# EAGLE design BBBBoat-cape (EAGLE 6.4)
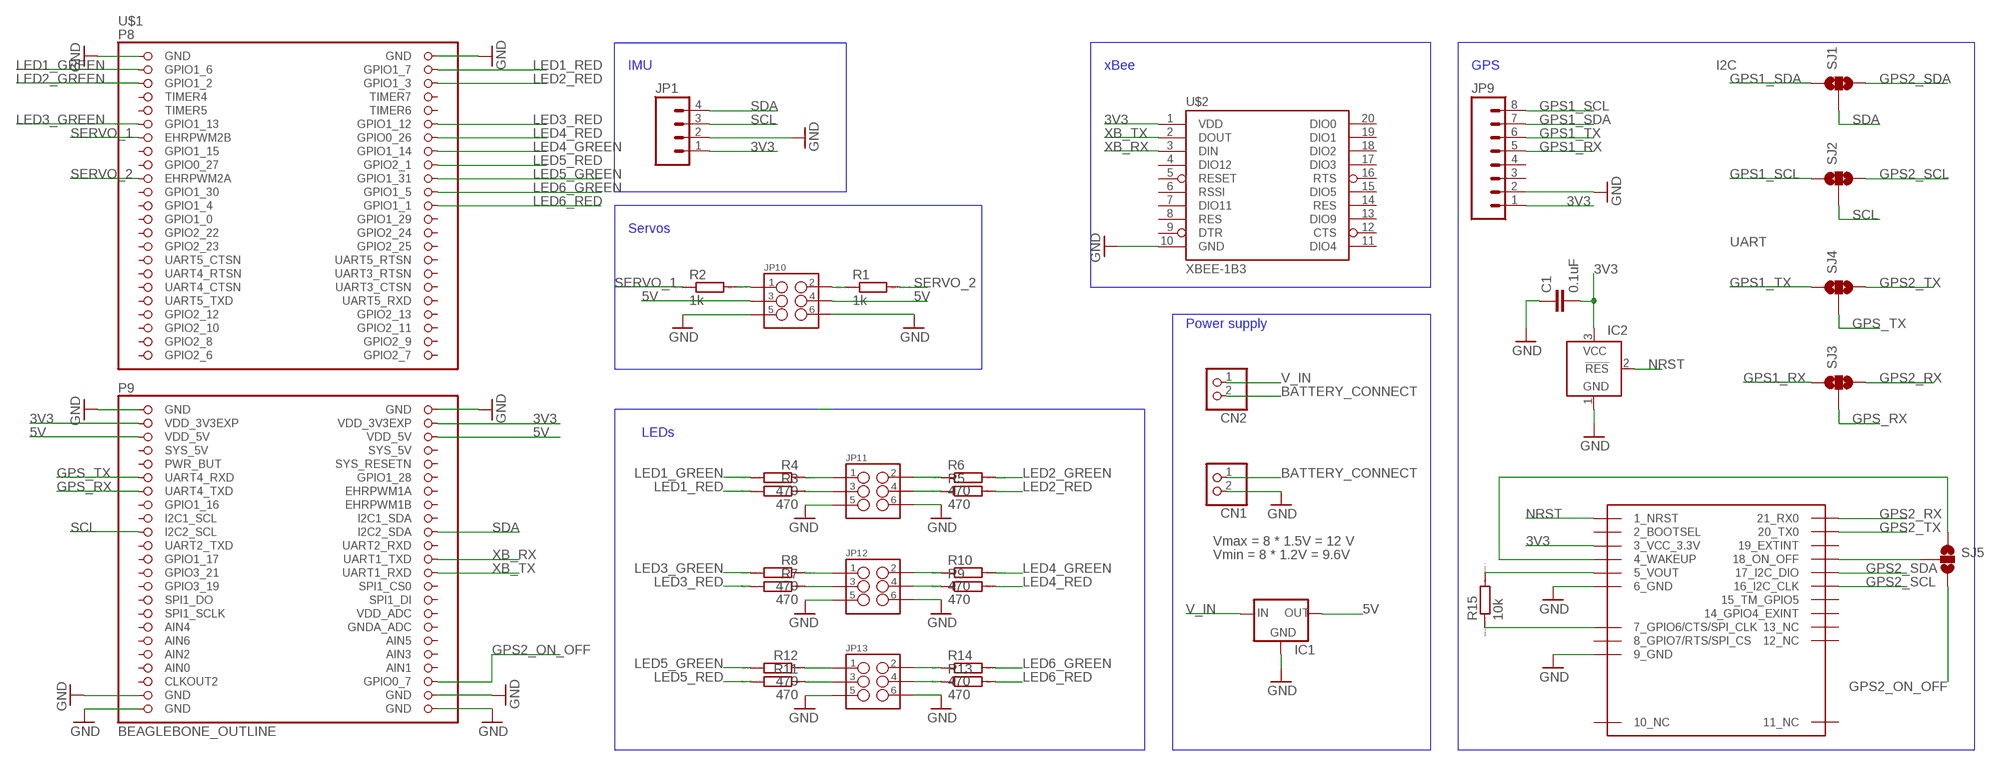
[diagram p0: schematic, sheet 1]

## Parts
C1  0.1uF  0.1UF-25V-5%(0603)  [0603-CAP]
CN1  JST_2PIN-SMT  [JST-PH-2-SMT]
CN2  JST_2PIN-SMT  [JST-PH-2-SMT]
IC1  V_REG_78XX-TO-220  [TO-220-ALT]
IC2  TCM809  [SOT23B-3]
JP1  M04SMD_STRAIGHT_COMBO  [1X04_SMD_STRAIGHT_COMBO]
JP9  M08SMD-MALE  [1X08_SMD_MALE]
JP10  M03X2  [2X3_SMD]
JP11  M03X2  [2X3_SMD]
JP12  M03X2  [2X3_SMD]
JP13  M03X2  [2X3_SMD]
R1  1k  R0204/7  [0204/7]
R2  1k  R0204/7  [0204/7]
R3  470  R0204/7  [0204/7]
R4  470  R0204/7  [0204/7]
R5  470  R0204/7  [0204/7]
R6  470  R0204/7  [0204/7]
R7  470  R0204/7  [0204/7]
R8  470  R0204/7  [0204/7]
R9  470  R0204/7  [0204/7]
R10  470  R0204/7  [0204/7]
R11  470  R0204/7  [0204/7]
R12  470  R0204/7  [0204/7]
R13  470  R0204/7  [0204/7]
R14  470  R0204/7  [0204/7]
R15  10k  R0204/7  [0204/7]
SJ1  SOLDERJUMPER_2WAYT  [SJ_2]
SJ2  SOLDERJUMPER_2WAYT  [SJ_2]
SJ3  SOLDERJUMPER_2WAYT  [SJ_2]
SJ4  SOLDERJUMPER_2WAYT  [SJ_2]
SJ5  SOLDERJUMPER_2WAYT  [SJ_2]
U$1  BEAGLEBONE_OUTLINE  [BEAGLEBONE_SHIELD]
U$2  XBEE-1B3  [XBEE-SMD]
U$3  A2035-H  [A2035H]

## Nets
3V3: C1.2 IC2.3(VCC) JP1.1 JP9.1 U$1.49(VDD_3V3EXP) U$1.50(VDD_3V3EXP) U$2.1(VDD) U$3.3_VCC_3.3V
5V: IC1.OUT JP10.3 JP10.4 U$1.51(VDD_5V) U$1.52(VDD_5V)
BATTERY_CONNECT: CN1.1 CN2.2
GND: C1.1 CN1.2 IC1.GND IC2.1(GND) JP1.2 JP9.2 JP10.5 JP10.6 JP11.5 JP11.6 JP12.5 JP12.6 JP13.5 JP13.6 U$1.1(GND) U$1.2(GND) U$1.47(GND) U$1.48(GND) U$1.89(GND) U$1.90(GND) U$1.91(GND) U$1.92(GND) U$2.10(GND) U$3.6_GND U$3.9_GND
GPS1_RX: JP9.5 SJ3.1
GPS1_SCL: JP9.8 SJ2.1
GPS1_SDA: JP9.7 SJ1.1
GPS1_TX: JP9.6 SJ4.1
GPS2_ON_OFF: SJ5.3 U$1.88(GPIO0_7)
GPS2_RX: SJ3.3 U$3.21_RX0
GPS2_SCL: SJ2.3 U$3.16_I2C_CLK
GPS2_SDA: SJ1.3 U$3.17_I2C_DIO
GPS2_TX: SJ4.3 U$3.20_TX0
GPS_RX: SJ3.2 U$1.59(UART4_TXD)
GPS_TX: SJ4.2 U$1.57(UART4_RXD)
LED1_GREEN: R4.2 U$1.3(GPIO1_6)
LED1_RED: R3.2 U$1.4(GPIO1_7)
LED2_GREEN: R6.2 U$1.5(GPIO1_2)
LED2_RED: R5.2 U$1.6(GPIO1_3)
LED3_GREEN: R8.2 U$1.11(GPIO1_13)
LED3_RED: R7.2 U$1.12(GPIO1_12)
LED4_GREEN: R10.2 U$1.16(GPIO1_14)
LED4_RED: R9.2 U$1.14(GPIO0_26)
LED5_GREEN: R12.2 U$1.20(GPIO1_31)
LED5_RED: R11.2 U$1.18(GPIO2_1)
LED6_GREEN: R14.2 U$1.22(GPIO1_5)
LED6_RED: R13.2 U$1.24(GPIO1_1)
N$1: JP11.3 R3.1
N$2: JP11.1 R4.1
N$3: JP11.4 R5.1
N$4: JP11.2 R6.1
N$5: JP12.3 R7.1
N$6: JP12.1 R8.1
N$7: JP12.4 R9.1
N$8: JP12.2 R10.1
N$9: JP13.3 R11.1
N$10: JP13.1 R12.1
N$11: JP13.4 R13.1
N$12: JP13.2 R14.1
N$13: R15.1 U$3.7_GPIO6/CTS/SPI_CLK
N$14: JP10.2 R1.1
N$15: R15.2 U$3.5_VOUT
N$16: JP10.1 R2.2
N$18: SJ5.2 U$3.18_ON_OFF
N$19: SJ5.1 U$3.4_WAKEUP
NRST: IC2.2(!RES) U$3.1_NRST
SCL: JP1.3 SJ2.2 U$1.65(I2C2_SCL)
SDA: JP1.4 SJ1.2 U$1.66(I2C2_SDA)
SERVO_1: R2.1 U$1.13(EHRPWM2B)
SERVO_2: R1.2 U$1.19(EHRPWM2A)
V_IN: CN2.1 IC1.IN
XB_RX: U$1.70(UART1_TXD) U$2.3(DIN)
XB_TX: U$1.72(UART1_RXD) U$2.2(DOUT)
Unconnected: JP9.3 JP9.4 U$1.7(TIMER4) U$1.8(TIMER7) U$1.9(TIMER5) U$1.10(TIMER6) U$1.15(GPIO1_15) U$1.17(GPIO0_27) U$1.21(GPIO1_30) U$1.23(GPIO1_4) U$1.25(GPIO1_0) U$1.26(GPIO1_29) U$1.27(GPIO2_22) U$1.28(GPIO2_24) U$1.29(GPIO2_23) U$1.30(GPIO2_25) U$1.31(UART5_CTSN) U$1.32(UART5_RTSN) U$1.33(UART4_RTSN) U$1.34(UART3_RTSN) U$1.35(UART4_CTSN) U$1.36(UART3_CTSN) U$1.37(UART5_TXD) U$1.38(UART5_RXD) U$1.39(GPIO2_12) U$1.40(GPIO2_13) U$1.41(GPIO2_10) U$1.42(GPIO2_11) U$1.43(GPIO2_8) U$1.44(GPIO2_9) U$1.45(GPIO2_6) U$1.46(GPIO2_7) U$1.54(SYS_5V) U$1.55(PWR_BUT) U$1.56(SYS_RESETN) U$1.58(GPIO1_28) U$1.60(EHRPWM1A) U$1.61(GPIO1_16) U$1.62(EHRPWM1B) U$1.63(I2C1_SCL) U$1.64(I2C1_SDA) U$1.67(UART2_TXD) U$1.68(UART2_RXD) U$1.69(GPIO1_17) U$1.71(GPIO3_21) U$1.73(GPIO3_19) U$1.74(SPI1_CS0) U$1.75(SPI1_DO) U$1.76(SPI1_DI) U$1.77(SPI1_SCLK) U$1.78(VDD_ADC) U$1.79(AIN4) U$1.80(GNDA_ADC) U$1.81(AIN6) U$1.82(AIN5) U$1.83(AIN2) U$1.84(AIN3) U$1.86(AIN1) U$1.87(CLKOUT2) U$2.4(DIO12) U$2.5(RESET) U$2.6(RSSI) U$2.7(DIO11) U$2.8(RES) U$2.9(DTR) U$2.11(DIO4) U$2.12(CTS) U$2.13(DIO9) U$2.14(RES) U$2.15(DIO5) U$2.16(RTS) U$2.17(DIO3) U$2.18(DIO2) U$2.19(DIO1) U$2.20(DIO0) U$3.2_BOOTSEL U$3.8/GPIO7/RTS/SPI_CS(8_GPIO7/RTS/SPI_CS) U$3.10_NC U$3.11_NC U$3.12_NC U$3.13_GPIO4_EXTINT(13_NC) U$3.14_GPIO_EXTINT(14_GPIO4_EXINT) U$3.15_TM_GPIO5 U$3.19_EXTINT

## Notes on the sheet
- IMU | xBee | GPS | I2C
- Servos
- UART
- Power supply
- LEDs
- Vmax = 8 * 1.5V = 12 V
- Vmin = 8 * 1.2V = 9.6V

## Power pins joined to a net without a drawn wire
AIN0: U$1.85(AIN0)
SYS_5V: U$1.53(SYS_5V)

## Library data of the parts
C1 = SparkFun-Capacitors:0.1UF-25V-5%(0603): CAP-08604; PROD_ID: CAP-08604
CN1 CN2 = adafruit:JST_2PIN: JST 2-Pin Connectors of various flavors SMT-RA (S2B-PH-SM4) 4UConnector #17311 SMT (B2B-PH-SM4) THM-RA (S2B-PH) THM (B2B-PH)
IC1 = SparkFun-PowerIC:V_REG_78XX: Voltage Regulator Standard 7805 5V regulator. IGO (Input Ground Output). Spark Fun Electronics SKU : COM-00107
IC2 = telcom:TCM809: POWER SUPPLY MONITOR replacement for Maxim MAX809 and MAX810; MF: MICROCHIP; MPN: TCM809MENB713; OC_FARNELL: 9762744; OC_NEWARK: 96K3998
JP1 = SparkFun-Connectors:M04: Header 4 Standard 4-pin 0.1" header. Use with straight break away headers (SKU : PRT-00116), right angle break away headers (PRT-00553), swiss pins (PRT-00743), machine pins (PRT-00117), and female headers (PRT-00115). Molex polarized connector foot print use with SKU : PRT-08231 with associated crimp pins and housings. 1MM SMD Version SKU: PRT-10208
JP9 = SparkFun-Connectors:M08: Header 8 Standard 8-pin 0.1" header. Use with straight break away headers (SKU : PRT-00116), right angle break away headers (PRT-00553), swiss pins (PRT-00743), machine pins (PRT-00117), and female headers (PRT-00115).; PROD_ID: CONN-11292
JP10-JP13 = SparkFun-Connectors:M03X2: 2x3 .1" header. Shrouded, with keying- CONN-10681 SMT- CONN-11415 Pogo pins- HW-11044; PROD_ID: CONN-11290
R1-R15 = eagle-ltspice:R: RESISTOR, European symbol; SPICEMODEL: NONE; SPICEPREFIX: R
SJ1-SJ5 = SparkFun-Retired:SOLDERJUMPER_2WAY: Solder Jumper 2 way solder jumper
U$1 = adafruit:BEAGLEBONE_OUTLINE: Should match A3 pinout - but not completely tested
U$2 = SparkFun-RF:XBEE-1: Xbee module footprints SMT header is CONN-09042.; PROD_ID: CONN-09042
U$3 = smaria:A2035-H

## Board
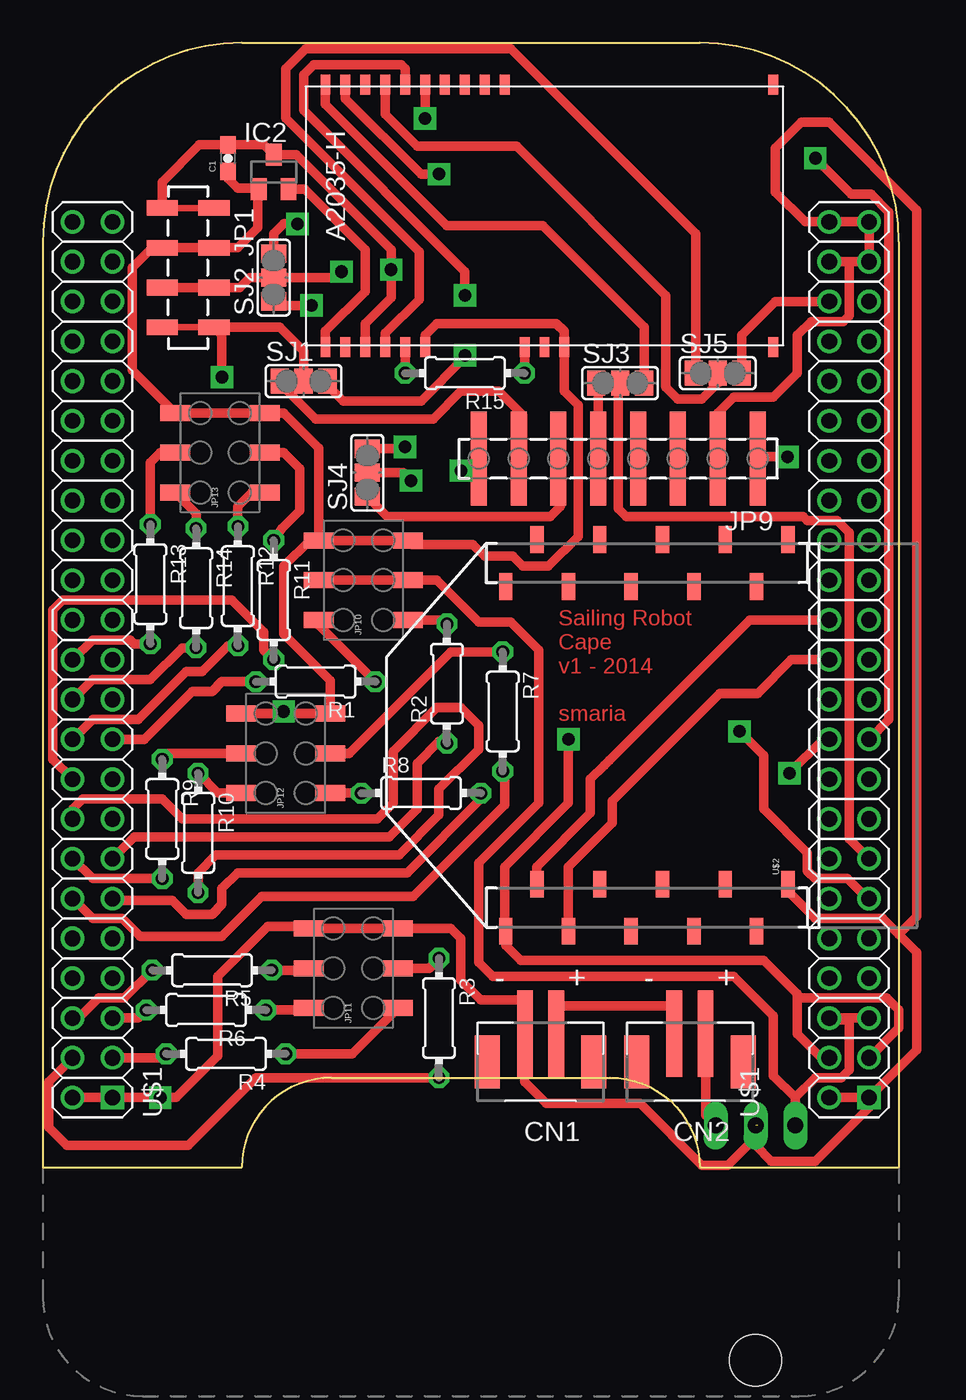
[diagram p1: board, top side]
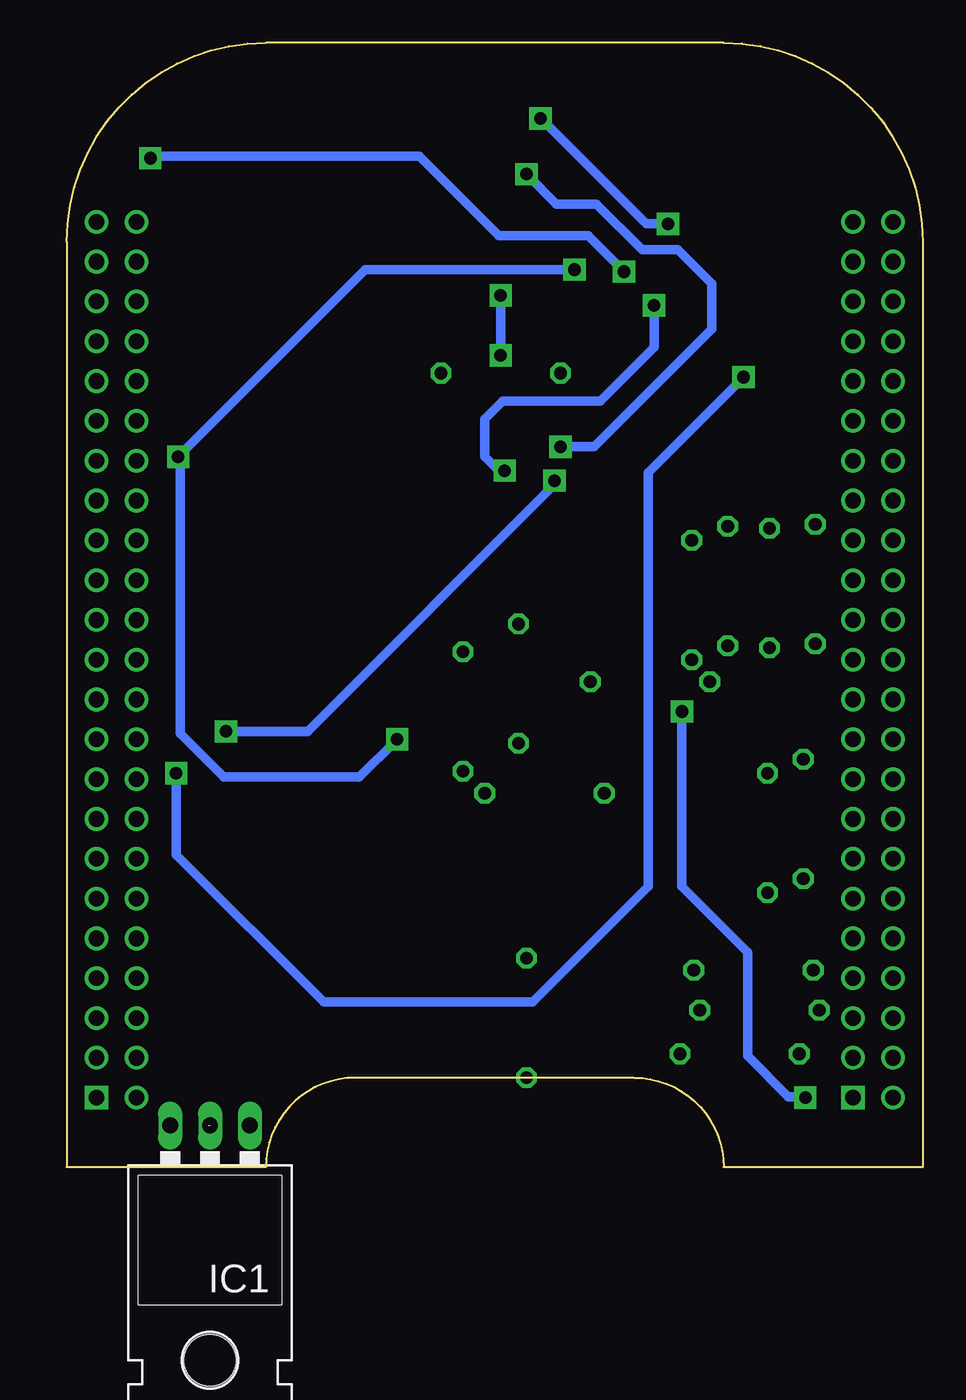
[diagram p2: board, bottom side, seen from below]

Size 54.61 x 71.75 mm. Coordinates in mm from the lower left corner, seen from the top.
Copper layers (1*16): Top 0.035mm / dielectric 1.5mm / Bottom 0.035mm
Design rules "default": minimum track width 10mil, minimum drill 24mil, track to track 8mil, track to pad 8mil, pad to pad 8mil, via to via 8mil, smd to smd 8mil, copper to edge 40mil, drill to drill 8mil, minimum pad ring 10mil, minimum via ring 8mil, stop-mask expansion 4mil, vias tented up to drill 0mil, thermal gap 10mil

### Footprints (pad centres in the part's own frame; a part is rotated, then mirrored left to right if it is on the bottom)
0603-CAP = smd 1.1 x 1: 1 -0.85,0; 2 0.85,0
JST-PH-2-SMT = smd 1 x 5.5: 1 -1,-1.8; 2 1,-1.8 | smd 1.6 x 3.4: NC1 -3.4,0; NC2 3.4,0
TO-220-ALT = drill 1.016 long: GND 0,-3.81; IN -2.54,-3.81; OUT 2.54,-3.81 | hole 3.302: 0,11.176
SOT23B-3 = smd 1 x 1.4: 1 -0.95,-1.1; 2 0.95,-1.1; 3 0,1.1
1X04_SMD_STRAIGHT_COMBO = smd 1 x 2: 1 0,-1.65; 1-2 0,1.65; 2 2.54,1.65; 2-2 2.54,-1.65; 3 5.08,-1.65; 3-2 5.08,1.65; 4 7.62,1.65; 4-2 7.62,-1.65
1X08_SMD_MALE = smd 1.02 x 6: 1 0,0; 2 2.54,0; 3 5.08,0; 4 7.62,0; 5 10.16,0; 6 12.7,0; 7 15.24,0; 8 17.78,0
2X3_SMD = smd 1.02 x 1.9: 1 -2.54,-2.85; 2 -2.54,2.85; 3 0,-2.85; 4 0,2.85; 5 2.54,-2.85; 6 2.54,2.85
0204/7 = drill 0.813 octagon: 1 -3.81,0; 2 3.81,0
SJ_2 = smd 1.168 x 1.6: 1 -1.524,0; 2 0,0; 3 1.524,0
BEAGLEBONE_SHIELD = drill 1 square: 1 4.445,19.05; 47 52.705,19.05 | drill 1: 2 1.905,19.05; 3 4.445,21.59; 4 1.905,21.59; 5 4.445,24.13; 6 1.905,24.13; 7 4.445,26.67; 8 1.905,26.67; 9 4.445,29.21; 10 1.905,29.21; 11 4.445,31.75; 12 1.905,31.75; 13 4.445,34.29; 14 1.905,34.29; 15 4.445,36.83; 16 1.905,36.83; 17 4.445,39.37; 18 1.905,39.37; 19 4.445,41.91; 20 1.905,41.91; 21 4.445,44.45; 22 1.905,44.45; 23 4.445,46.99; 24 1.905,46.99; 25 4.445,49.53; 26 1.905,49.53; 27 4.445,52.07; 28 1.905,52.07; 29 4.445,54.61; 30 1.905,54.61; 31 4.445,57.15; 32 1.905,57.15; 33 4.445,59.69; 34 1.905,59.69; 35 4.445,62.23; 36 1.905,62.23; 37 4.445,64.77; 38 1.905,64.77; 39 4.445,67.31; 40 1.905,67.31; 41 4.445,69.85; 42 1.905,69.85; 43 4.445,72.39; 44 1.905,72.39; 45 4.445,74.93; 46 1.905,74.93; 48 50.165,19.05; 49 52.705,21.59; 50 50.165,21.59; 51 52.705,24.13; 52 50.165,24.13; 53 52.705,26.67; 54 50.165,26.67; 55 52.705,29.21; 56 50.165,29.21; 57 52.705,31.75; 58 50.165,31.75; 59 52.705,34.29; 60 50.165,34.29; 61 52.705,36.83; 62 50.165,36.83; 63 52.705,39.37; 64 50.165,39.37; 65 52.705,41.91; 66 50.165,41.91; 67 52.705,44.45; 68 50.165,44.45; 69 52.705,46.99; 70 50.165,46.99; 71 52.705,49.53; 72 50.165,49.53; 73 52.705,52.07; 74 50.165,52.07; 75 52.705,54.61; 76 50.165,54.61; 77 52.705,57.15; 78 50.165,57.15; 79 52.705,59.69; 80 50.165,59.69; 81 52.705,62.23; 82 50.165,62.23; 83 52.705,64.77; 84 50.165,64.77; 85 52.705,67.31; 86 50.165,67.31; 87 52.705,69.85; 88 50.165,69.85; 89 52.705,72.39; 90 50.165,72.39; 91 52.705,74.93; 92 50.165,74.93
XBEE-SMD = smd 1.7 x 0.85: 1 -12.5,20; 2 -9.5,18; 3 -12.5,16; 4 -9.5,14; 5 -12.5,12; 6 -9.5,10; 7 -12.5,8; 8 -9.5,6; 9 -12.5,4; 10 -9.5,2; 11 12.5,2; 12 9.5,4; 13 12.5,6; 14 9.5,8; 15 12.5,10; 16 9.5,12; 17 12.5,14; 18 9.5,16; 19 12.5,18; 20 9.5,20
A2035H = smd 1.27 x 0.635: 1_NRST 16.637,1.27; 2_BOOTSEL 16.637,2.54; 3_VCC_3.3V 16.637,3.81; 4_WAKEUP 16.637,5.08; 5_VOUT 16.637,6.35; 6_GND 16.637,7.62; 7_GPIO6/CTS/SPI_CLK 16.637,13.97; 8/GPIO7/RTS/SPI_CS 16.637,15.24; 9_GND 16.637,16.51; 10_NC 16.637,29.845; 11_NC -0.127,29.845; 12_NC -0.127,12.7; 13_GPIO4_EXTINT -0.127,11.43; 14_GPIO_EXTINT -0.127,10.16; 15_TM_GPIO5 -0.127,8.89; 16_I2C_CLK -0.127,7.62; 17_I2C_DIO -0.127,6.35; 18_ON_OFF -0.127,5.08; 19_EXTINT -0.127,3.81; 20_TX0 -0.127,2.54; 21_RX0 -0.127,1.27

### Placement (x,y rotation side)
C1  11.81,64.39 90 top
CN1  31.75,6.73 180 top
CN2  41.27,6.73 180 top
IC1  45.47,-1.14 180 bottom
IC2  14.73,63.5 0 top
JP1  9.27,61.21 270 top
JP9  45.59,45.21 180 top
JP10  20.45,37.47 90 top
JP11  19.81,12.7 90 top
JP12  15.49,26.42 90 top
JP13  11.3,45.59 90 top
R1  17.4,30.99 180 top
R2  25.78,30.86 90 top
R3  25.27,9.52 270 top
R4  11.68,7.24 180 top
R5  10.79,12.57 180 top
R6  10.41,10.03 180 top
R7  29.34,29.08 270 top
R8  24.13,23.88 0 top
R9  7.62,22.22 270 top
R10  9.91,21.34 270 top
R11  14.73,36.19 270 top
R12  12.45,37.08 270 top
R13  6.86,37.21 270 top
R14  9.78,36.96 270 top
R15  26.92,50.67 180 top
SJ1  16.64,50.16 0 top
SJ2  14.73,56.77 90 top
SJ3  36.83,50.04 0 top
SJ4  20.7,44.32 90 top
SJ5  43.05,50.67 0 top
U$1  0,-14.61 0 top
U$2  49.53,27.56 90 top
U$3  16.76,68.96 270 top

### Tracks (layer width: path | path; a pad name or v marks a point on that pad's centre or on a via)
3V3  (via drill 0.8 pad 1.42)
  Top 0.61: JP1.1 7.62,62.86 9.99,65.24 C1.2 14.09,65.24 IC2.3 16.17,64.6 22.23,58.55 v22.23,57.28 22.23,55.5 20.57,53.85 U$3.3_VCC_3.3V | v47.5,45.34 45.72,45.34 JP9.1 | U$1.50 49.66,6.98 48.13,8.51 48.13,10.79 | 48.13,10.79 48.13,11.05 45.97,13.21 30.48,13.21 29.53,14.16 U$2.1 29.46,15.12 29.46,19.18 33.53,23.24 v33.53,27.3 | U$1.49 54.61,8.89 54.61,10.03 53.85,10.79 48.13,10.79
  Bottom 0.61: v33.53,27.3 35.94,24.89 44.58,24.89 47.37,27.69 47.37,45.21 v47.5,45.34 35.56,57.28 v22.23,57.28
5V
  Top 0.61: IC1.OUT 48.01,4.44 | 48.01,4.44 49.28,5.71 50.93,5.71 51.43,6.22 51.43,9.4 50.29,9.4 U$1.52 U$1.51 | JP10.4 JP10.3 25.15,37.47 27.81,34.8 29.85,34.8 31.62,33.02 31.62,23.24 27.81,19.43 27.81,13.08 28.7,12.19 44.07,12.19 46.61,9.65 46.61,5.84 48.01,4.44
BATTERY_CONNECT
  Top 0.61: CN1.1 32.75,10.14 32.89,10.29 40.39,10.29 40.51,10.16 40.51,9.18 CN2.2
GND  (via drill 0.8 pad 1.42)  (1 unrouted)
  Top 0.61: JP12.6 JP12.5 | C1.1 11.81,63.12 12.45,62.48 13.7,62.48 IC2.1 13.72,62.33 13.72,59.94 12.45,58.67 JP1.2 10.79,58.55 10.67,58.67 6.99,58.67 5.71,57.4 5.71,50.87 JP13.6 JP13.5 15.37,48.13 17.6,45.9 JP10.6 | U$1.2 U$1.1 v7.49,4.44 8.51,4.44 11.18,7.11 11.18,12.19 14.35,15.37 16.84,15.37 JP11.6 JP11.5 26.04,15.24 26.67,14.61 26.67,11.94 27.94,10.67 30.75,10.67 CN1.2 30.75,5.44 32.13,4.06 38.1,4.06 42.04,0.13 43.69,0.13 45.59,2.03 45.59,2.67 45.47,2.79 | 51.43,57.78 U$1.89 U$1.91 U$1.92 48.64,60.32 46.74,62.23 46.74,65.02 48.39,66.67 50.16,66.67 55.75,61.09 55.75,16 54.61,14.86 | U$1.48 U$1.47 | U$2.10 47.53,17.62 49.28,15.88 53.59,15.88 54.61,14.86 | U$1.47 55.75,7.49 55.75,13.72 54.61,14.86 | IC1.GND 45.47,1.4 46.48,0.38 49.28,0.38 52.7,3.81 U$1.47 | U$1.90 51.43,57.78 | 51.43,57.78 51.43,54.36 51.05,53.97 49.02,53.97 48.13,53.09 48.13,50.67 46.61,49.15 44.07,49.15 43.05,48.13 JP9.2 | JP10.6 JP10.5 23.55,39.75 27.43,39.75 28.19,38.99 29.97,38.99 30.61,38.35 32.26,38.35 34.16,40.26 34.16,48.64 33.27,49.53 U$3.9_GND 33.27,53.34 32.77,53.85 25.15,53.85 24.38,53.09 U$3.6_GND | JP10.6 17.02,40 15.37,38.35 15.37,34.04 18.34,31.06 JP12.5 | JP12.5 15.37,28.96 v15.37,29.08
  Bottom 0.61: v7.49,4.44 7.56,4.51 8.57,4.51 11.18,7.11 11.18,13.72 15.37,17.91 v15.37,29.08
GPS1_RX
  Top 0.61: SJ3.1 35.43,50.16 JP9.5
GPS1_SCL  (via drill 0.8 pad 1.42)
  Top 0.61: JP9.8 27.81,44.58 26.8,44.58 v26.67,44.45 | SJ2.1 14.99,54.99 v17.14,54.99
  Bottom 0.61: v17.14,54.99 17.14,52.32 20.57,48.89 26.8,48.89 27.94,47.75 27.94,45.34 27.18,44.58 26.8,44.58 v26.67,44.45
GPS1_SDA
  Top 0.61: SJ1.1 15.11,50.04 17.4,47.75 24.89,47.75 26.67,49.53 29.08,49.53 30.61,48.01 30.61,45.21 JP9.7
GPS1_TX
  Top 0.61: JP9.6 33.02,45.08 33.02,42.16 32.38,41.53 21.97,41.53 SJ4.1
GPS2_ON_OFF
  Top 0.61: U$1.88 46.74,55.25 44.58,53.09 SJ5.3
GPS2_RX
  Top 0.61: U$3.21_RX0 18.03,67.82 25.78,60.07 31.88,60.07 38.35,53.59 SJ3.3
GPS2_SCL  (via drill 0.8 pad 1.42)
  Top 0.61: U$3.16_I2C_CLK v24.38,66.93 | v16.26,60.2 15.37,60.2 14.73,59.56 SJ2.3
  Bottom 0.61: v24.38,66.93 17.65,60.2 v16.26,60.2
GPS2_SDA  (via drill 0.8 pad 1.42)
  Top 0.61: U$3.17_I2C_DIO 23.11,70.1 22.86,70.36 17.27,70.36 16.64,69.72 16.64,67.44 26.92,57.15 v26.92,55.63 | SJ1.3 18.16,49.91 19.18,48.89 24.13,48.89 26.92,51.69 v26.92,51.82
  Bottom 0.61: v26.92,55.63 v26.92,51.82
GPS2_TX  (via drill 0.8 pad 1.42)
  Top 0.61: U$3.20_TX0 19.3,68.2 24.13,63.37 v25.27,63.37 | v23.11,45.97 22.99,45.85 SJ4.3
  Bottom 0.61: v25.27,63.37 23.37,61.47 20.83,61.47 17.91,58.55 15.62,58.55 13.46,56.39 13.46,53.47 20.96,45.97 v23.11,45.97
GPS_RX
  Top 0.61: U$1.59 51.43,20.95 51.43,40.51 50.67,41.28 48.77,41.28 48.51,41.53 37.21,41.53 36.7,42.04 36.7,49.91 SJ3.2
GPS_TX  (via drill 0.8 pad 1.42)
  Top 0.61: U$1.57 52.58,17.14 51.31,18.41 49.28,18.41 48.77,18.92 48.77,20.07 45.97,22.86 45.97,26.29 v44.45,27.81 | SJ4.2 22.99,44.32 v23.5,43.81
  Bottom 0.61: v44.45,27.81 39.24,27.81 23.5,43.56 v23.5,43.81
LED1_GREEN
  Top 0.61: U$1.3 7.62,6.98 R4.2
LED1_RED
  Top 0.61: U$1.4 0.38,5.46 0.38,2.54 1.52,1.4 9.27,1.4 13.59,5.71 R3.2
LED2_GREEN
  Top 0.61: U$1.5 6.1,9.52 R6.2
LED2_RED
  Top 0.61: U$1.6 2.29,9.52 3.56,10.79 5.21,10.79 R5.2
LED3_GREEN
  Top 0.61: U$1.11 4.57,17.02 8.25,17.02 9.14,16.13 10.79,16.13 11.43,16.76 11.43,17.78 12.45,18.8 23.24,18.8 27.94,23.49 R8.2
LED3_RED
  Top 0.61: U$1.12 3.17,15.88 5.08,15.88 6.22,14.73 11.43,14.73 13.97,17.27 23.62,17.27 29.46,23.11 29.46,25.15 R7.2
LED4_GREEN
  Top 0.61: U$1.16 1.91,22.86 2.54,23.49 7.62,23.49 8.89,22.22 21.34,22.22 22.35,23.24 22.35,26.54 25.15,29.34 26.67,29.34 27.81,28.19 27.81,26.67 25.27,24.13 25.27,22.48 22.73,19.94 11.05,19.94 9.91,18.8 R10.2
LED4_RED
  Top 0.61: U$1.14 3.17,18.41 R9.2
LED5_GREEN
  Top 0.61: R12.2 11.81,33.27 10.16,31.62 9.14,31.62 6.1,28.57 3.17,28.57 U$1.20
LED5_RED
  Top 0.61: U$1.18 0.64,26.04 0.64,35.56 1.27,36.19 12.06,36.19 14.1,34.16 14.1,33.02 R11.2
LED6_GREEN
  Top 0.61: R14.2 8.89,33.15 6.86,31.11 3.17,31.11 U$1.22
LED6_RED
  Top 0.61: U$1.24 3.17,33.66 5.59,33.66 5.84,33.4 R13.2
N$1
  Top 0.61: JP11.3 24.64,12.7 R3.1
N$2
  Top 0.61: R4.1 19.74,7.24 JP11.1
N$3
  Top 0.61: R5.1 16.84,12.57 JP11.4
N$4
  Top 0.61: R6.1 16.84,10.03 JP11.2
N$5
  Top 0.61: JP12.3 19.56,26.42 26.04,32.89 R7.1
N$6
  Top 0.61: JP12.1 R8.1
N$7
  Top 0.61: JP12.4 8,26.42 R9.1
N$8
  Top 0.61: R10.1 11.18,23.88 JP12.2
N$9
  Top 0.61: JP13.3 15.37,45.59 16.38,44.58 16.38,41.91 15.24,40.77 R11.1
N$10
  Top 0.61: R12.1 12.45,42.16 13.33,43.05 JP13.1
N$11
  Top 0.61: R13.1 6.86,44.96 7.49,45.59 JP13.4
N$12
  Top 0.61: R14.1 9.78,41.73 JP13.2
N$13
  Top 0.61: U$3.7_GPIO6/CTS/SPI_CLK R15.1
N$14
  Top 0.61: JP10.2 17.6,34.6 R1.1
N$15
  Top 0.61: U$3.5_VOUT R15.2
N$16
  Top 0.61: JP10.1 25.53,34.92 R2.2
N$18
  Top 0.61: U$3.18_ON_OFF 21.84,67.18 23.88,65.15 30.23,65.15 39.75,55.63 39.75,49.78 40.51,49.02 42.04,49.02 43.05,50.04 SJ5.2
N$19
  Top 0.61: SJ5.1 41.66,50.8 41.66,59.56 29.85,71.37 16.76,71.37 15.49,70.1 15.49,66.93 24,58.42 24,55.37 21.84,53.21 U$3.4_WAKEUP
NRST
  Top 0.61: IC2.2 16.72,62.4 20.57,58.55 20.57,55.88 18.03,53.34 U$3.1_NRST
SCL  (via drill 0.8 pad 1.42)
  Top 0.61: JP1.3 12.57,56.13 13.21,56.77 SJ2.2 18.67,56.77 v19.05,57.15 | v49.28,64.39 51.56,62.1 52.83,62.1 53.97,60.96 53.97,28.57 U$1.65
  Bottom 0.61: v49.28,64.39 49.15,64.52 32.13,64.52 27.05,59.44 21.34,59.44 v19.05,57.15
SDA  (via drill 0.8 pad 1.42)
  Top 0.61: SJ1.2 16.64,52.07 15.11,53.59 JP1.4 11.43,53.08 v11.43,50.42 | U$1.66 49.78,27.3 v47.62,25.15
  Bottom 0.61: v47.62,25.15 47.62,19.94 38.23,10.54 24.89,10.54 17.53,17.91 17.53,44.32 v11.43,50.42
SERVO_1
  Top 0.61: U$1.13 5.84,21.08 22.1,21.08 23.88,22.86 23.88,25.78 25.27,27.18 R2.1
SERVO_2
  Top 0.61: U$1.19 6.48,27.3 9.52,30.35 10.79,30.35 11.43,30.99 R1.2
V_IN
  Top 0.61: CN2.1 42.27,3.32 IC1.IN
XB_RX
  Top 0.61: U$1.70 47.75,32.39 45.59,30.23 43.18,30.23 36.32,23.37 36.32,21.97 33.53,19.18 U$2.3
XB_TX
  Top 0.61: U$1.72 45.09,34.92 36.13,25.97 35.81,25.65 34.92,24.76 34.92,22.61 31.5,19.18 31.5,18.09 U$2.2

### Text on the board
Top: Sailing Robot / Cape / v1 - 2014 / / smaria
Dimension: lower end - keep usb client accessible for debugging